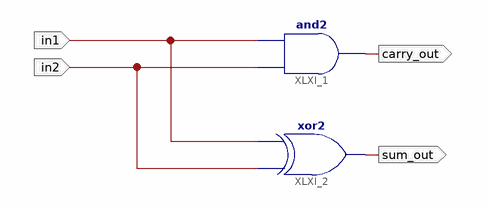
[diagram p0: schematic sheet 1]
// Xilinx ISE schematic Halbaddierer.sch (spartan3e) as structural Verilog: 2 symbols, 4 ports
module Halbaddierer (
  input  in1,
  input  in2,
  output carry_out,
  output sum_out
);

  and XLXI_1 (carry_out, in2, in1);
  xor XLXI_2 (sum_out, in2, in1);
endmodule
